# Altium schematic sheet Power.SchDoc: N64 Controller
size A4; DrawnBy: TheComet
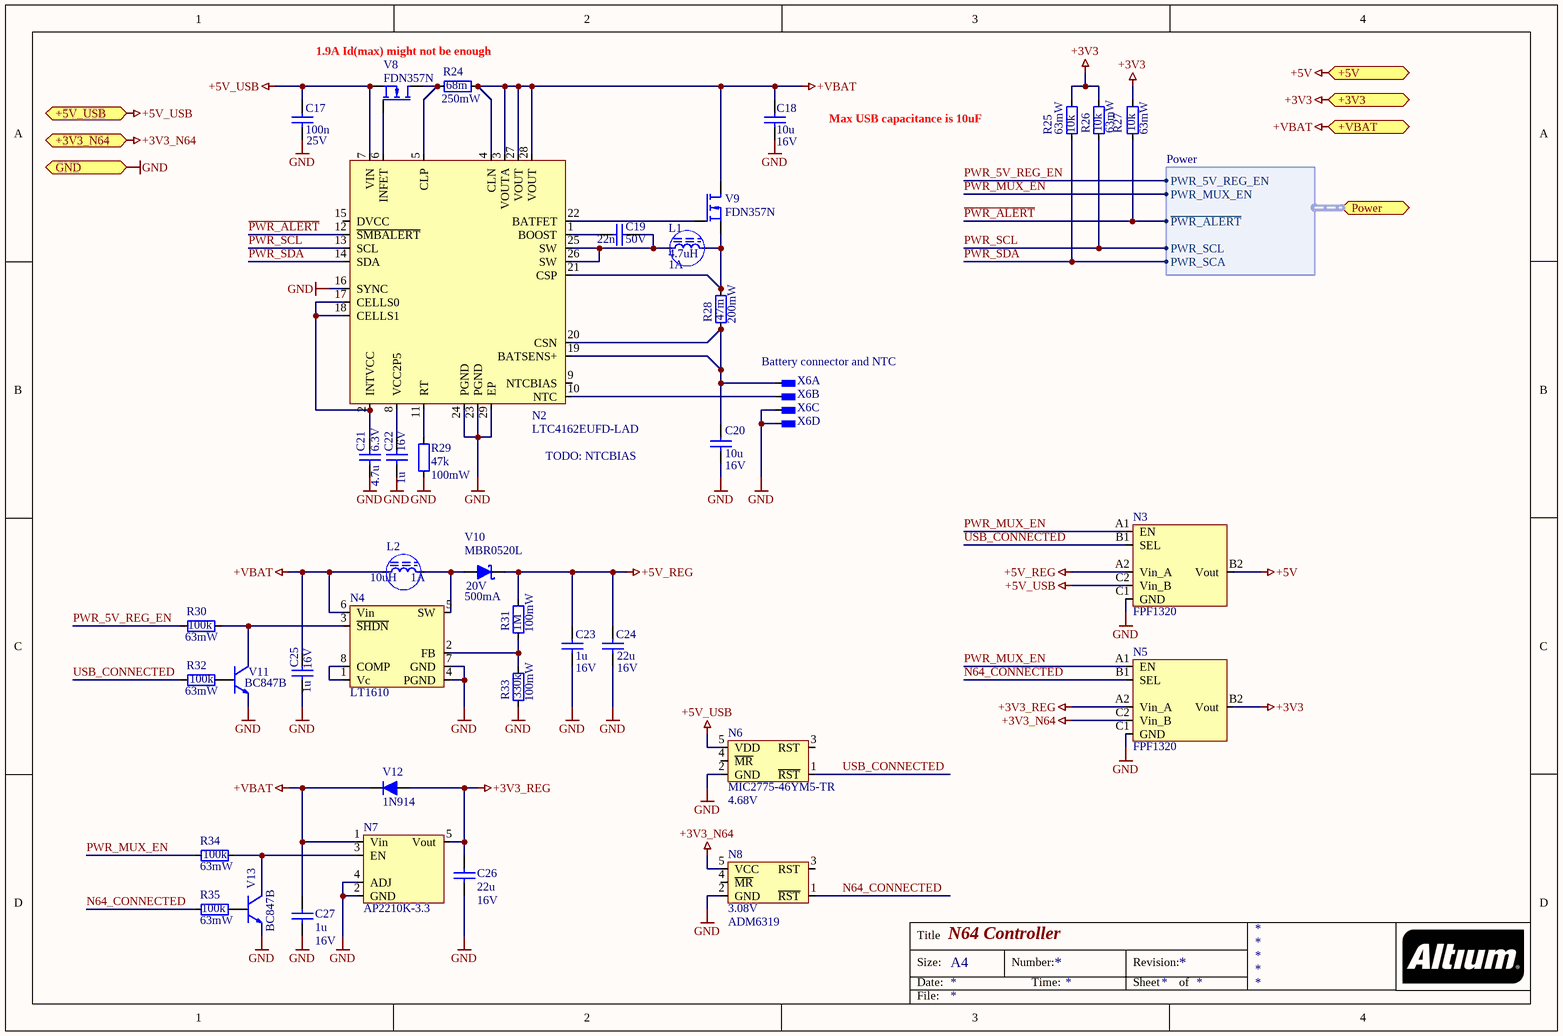
[diagram p0: Power.SchDoc]

## Parts
C17  value 100n  Value2: 25V  [SMD_CAP_0402]  (hidden comment: C_SMD_CER_100N_25V_10%_X7R_0402)
C18  value 10u  Value2: 16V  [SMD_CAP_0805]  (hidden comment: C_SMD_CER_10U_16V_10%_X7R_0805)
C19  value 22n  Value2: 50V  [SMD_CAP_0402]  (hidden comment: C_SMD_CER_22N_50V_10%_X7R_0402)
C20  value 10u  Value2: 16V  [SMD_CAP_0805]  (hidden comment: C_SMD_CER_10U_16V_10%_X7R_0805)
C21  value 4.7u  Value2: 6.3V  [SMD_CAP_0603]  (hidden comment: C_SMD_CER_4U7_6V3_10%_X5R_0603)
C22  value 1u  Value2: 16V  [SMD_CAP_0603]  (hidden comment: C_SMD_CER_1U_16V_10%_X7R_0603)
C23  value 1u  Value2: 16V  [SMD_CAP_0603]  (hidden comment: C_SMD_CER_1U_16V_10%_X7R_0603)
C24  value 22u  Value2: 16V  [SMD_CAP_0805]  (hidden comment: C_SMD_CER_22U_16V_10%_X5R_0805)
C25  value 1u  Value2: 16V  [SMD_CAP_0603]  (hidden comment: C_SMD_CER_1U_16V_10%_X7R_0603)
C26  value 22u  Value2: 16V  [SMD_CAP_0805]  (hidden comment: C_SMD_CER_22U_16V_10%_X5R_0805)
C27  value 1u  Value2: 16V  [SMD_CAP_0603]  (hidden comment: C_SMD_CER_1U_16V_10%_X7R_0603)
L1  value 4.7uH  Value2: 1A  [SMD_IND_0806]  (hidden comment: L_SMD_FERRITE_SHIELD_4U7_1A_20%_0806)
L2  value 10uH  Value2: 1A  [SMD_INDUCT-744025100]  (hidden comment: L_SMD_FERRITE_SHIELD_10U_1A_190MOHM_20%)
N2  Type: LTC4162EUFD-LAD  [QFN50P400X500X80_HS-29N]  (hidden comment: N_LTC4162EUFD-LAD_QFN-28)
N3  Type: FPF1320  [SMD_WLCSP_6_1.0X1.5]  (hidden comment: *)
N4  Type: LT1610  [SMD_MSOP-8]  (hidden comment: N_LT1610_MSOP-8)
N5  Type: FPF1320  [SMD_WLCSP_6_1.0X1.5]  (hidden comment: *)
N6  value 4.68V  Type: MIC2775-46YM5-TR  [SMD_SOT_23_5]  (hidden comment: N_MIC2775-46YM5-TR_SOT-23-5)
N7  AP2210K-3.3  [SMD_SOT_23_5]
N8  value 3.08V  Type: ADM6319  [SMD_SOT_23_5]  (hidden comment: N_ADM6319B31ARJZ-RL7_SOT-23-5)
R24  value 68m  Value2: 250mW  [SMD_RES_0603]  (hidden comment: R_SMD_THINFILM_0E068_0W25_1%_350PPM_0603)
R25  value 10k  Value2: 63mW  [SMD_RES_0402]  (hidden comment: R_SMD_THINFILM_10K_0W063_0%5_25PPM_0402)
R26  value 10k  Value2: 63mW  [SMD_RES_0402]  (hidden comment: R_SMD_THINFILM_10K_0W063_0%5_25PPM_0402)
R27  value 10k  Value2: 63mW  [SMD_RES_0402]  (hidden comment: R_SMD_THINFILM_10K_0W063_0%5_25PPM_0402)
R28  value 47m  Value2: 200mW  [SMD_RES_0603]  (hidden comment: R_SMD_THICKFILM_0E047_0W2_1%_200PPM_0603)
R29  value 47k  Value2: 100mW  [SMD_RES_0402]  (hidden comment: R_SMD_THINFILM_47K_0W1_0%5_25PPM_0402)
R30  value 100k  Value2: 63mW  [SMD_RES_0402]  (hidden comment: R_SMD_THINFILM_100K_0W063_1%_50PPM_0402)
R31  value 1M  Value2: 100mW  [SMD_RES_0402]  (hidden comment: R_SMD_THINFILM_1M_0W1_1%_50PPM_0402)
R32  value 100k  Value2: 63mW  [SMD_RES_0402]  (hidden comment: R_SMD_THINFILM_100K_0W063_1%_50PPM_0402)
R33  value 330k  Value2: 100mW  [SMD_RES_0402]  (hidden comment: R_SMD_THINFILM_330K_0W1_1%_50PPM_0402)
R34  value 100k  Value2: 63mW  [SMD_RES_0402]  (hidden comment: R_SMD_THINFILM_100K_0W063_1%_50PPM_0402)
R35  value 100k  Value2: 63mW  [SMD_RES_0402]  (hidden comment: R_SMD_THINFILM_100K_0W063_1%_50PPM_0402)
V8  Type: FDN357N  [SMD_SOT_23_3]  (hidden comment: V_SMD_FET_NMOS_FDN357N_30V_1A9_4NC2_0W5_SOT-23-3)
V9  Type: FDN357N  [SMD_SOT_23_3]  (hidden comment: V_SMD_FET_NMOS_FDN357N_30V_1A9_4NC2_0W5_SOT-23-3)
V10  value 20V  Type: MBR0520L  Value2: 500mA  [SMD_SOD_123]  (hidden comment: V_SMD_SCHOTTKY_MBR0520L_20V_0A5_SOD-123)
V11  Type: BC847B  [SMD_SOT_23_3]  (hidden comment: V_SMD_TRANS_NPN_BC847B_50V_0A2_SOT-23-3)
V12  Type: 1N914  [SMD_SOD_323]  (hidden comment: V_SMD_DIODE_1N914_75V_0A15_SOD-323)
V13  Type: BC847B  [SMD_SOT_23_3]  (hidden comment: V_SMD_TRANS_NPN_BC847B_50V_0A2_SOT-23-3)
X6  X_CONNECTOR_P2.54_D0.9_1X4  [THT_CON_P2.54_D0.9_1X4]  (value not drawn)  (parts A,B,C,D of 4)

## Ports
+3V3, +3V3_N64, +5V, +5V_USB, +VBAT, GND, Power (harness Power)

## Harnesses
Power: PWR_5V_REG_EN, ~{PWR_ALERT}, PWR_MUX_EN, PWR_SCL, PWR_SCA

## Nets
+3V3: N5.B2(Vout) R25.2 R26.2 R27.2 ; port +3V3
+3V3_N64: N5.C2(Vin_B) N8.5(VCC) ; port +3V3_N64
+3V3_REG: C26.2 N5.A2(Vin_A) N7.5(Vout) V12.1
+5V: N3.B2(Vout) ; port +5V
+5V_REG: C23.2 C24.2 N3.A2(Vin_A) R31.2 V10.2
+5V_USB: C17.2 N2.7(VIN) N3.C2(Vin_B) N6.5(VDD) V8.2(Source) ; port +5V_USB
+VBAT: C18.2 C25.2 C27.2 L2.1 N2.3(VOUTA) N2.4(CLN) N2.27(VOUT) N2.28(VOUT) N4.6(Vin) N7.1(Vin) R24.2 V9.3(Drain) V12.2 ; port +VBAT
GND: C17.1 C18.1 C20.1 C21.1 C22.1 C23.1 C24.1 C25.1 C26.1 C27.1 N2.16(SYNC) N2.23(PGND) N2.24(PGND) N2.29(EP) N3.C1(GND) N4.4(PGND) N4.7(GND) N5.C1(GND) N6.2(GND) N7.2(GND) N7.4(ADJ) N8.2(GND) R29.1 R33.1 V11.2(E) V13.2(E) X6.3 X6.4 ; port GND
N64_CONNECTED: N5.B1(SEL) N8.1(~{RST}) R35.1
~{PWR_ALERT}: N2.12(~{SMBALERT}) R27.1 ; port Power.~{PWR_ALERT}
PWR_5V_REG_EN: R30.1 ; port Power.PWR_5V_REG_EN
PWR_MUX_EN: N3.A1(EN) N5.A1(EN) R34.1 ; port Power.PWR_MUX_EN
PWR_SCL: N2.13(SCL) R26.1 ; port Power.PWR_SCL
PWR_SDA: N2.14(SDA) R25.1 ; port Power.PWR_SCA
USB_CONNECTED: N3.B1(SEL) N6.1(~{RST}) R32.1
NetC19_1: C19.1 N2.1(BOOST)
NetC19_2: C19.2 L1.1 N2.25(SW) N2.26(SW)
NetC20_2: C20.2 N2.19(BATSENS+) N2.20(CSN) R28.1 X6.1
NetC21_2: C21.2 N2.2(INTVCC) N2.17(CELLS0) N2.18(CELLS1)
NetC22_2: C22.2 N2.8(VCC2P5)
NetL1_2: L1.2 N2.21(CSP) R28.2 V9.2(Source)
NetL2_2: L2.2 N4.5(SW) V10.1
NetN2_5: N2.5(CLP) R24.1 V8.3(Drain)
NetN2_6: N2.6(INFET) V8.1(Gate)
NetN2_10: N2.10(NTC) X6.2
NetN2_11: N2.11(RT) R29.2
NetN2_22: N2.22(BATFET) V9.1(Gate)
NetN4_1: N4.1(Vc) N4.8(COMP)
NetN4_2: N4.2(FB) R31.1 R33.2
NetN4_3: N4.3(~{SHDN}) R30.2 V11.3(C)
NetN7_3: N7.3(EN) R34.2 V13.3(C)
NetR32_2: R32.2 V11.1(B)
NetR35_2: R35.2 V13.1(B)

Not connected (* = marked no-connect by the designer): N2 9(NTCBIAS) 15(DVCC); N6 3(RST) 4(~{MR}); N8 3(RST) 4(~{MR})

## Notes on the sheet
- 1.9A Id(max) might not be enough
- Max USB capacitance is 10uF
- (near X6) Battery connector and NTC
- (near N2) TODO: NTCBIAS
- Title
- Size:
- Date:
- A4
- Number:
- Time:
- Revision:
- Sheet
- of
- File:

## Library data of the parts
C17 = C_SMD_CER_100N_25V_10%_X7R_0402: 0.1µF ±10% 25V Ceramic Capacitor X7R 0402 (1005 Metric); Supplier - Digikey: 490-14603-1-ND
C18 C20 = C_SMD_CER_10U_16V_10%_X7R_0805: 10µF ±10% 16V Ceramic Capacitor X7R 0805 (2012 Metric); Supplier - Digikey: 1276-6472-1-ND
C19 = C_SMD_CER_22N_50V_10%_X7R_0402: 0.022µF ±10% 50V Ceramic Capacitor X7R 0402 (1005 Metric); Supplier - Digikey: 490-3884-1-ND
C22 C23 C25 C27 = C_SMD_CER_1U_16V_10%_X7R_0603: 1µF ±10% 16V Ceramic Capacitor X7R 0603 (1608 Metric); Supplier - Digikey: 1276-1019-1-ND
C24 C26 = C_SMD_CER_22U_16V_10%_X5R_0805: 22µF ±10% 16V Ceramic Capacitor X5R 0805 (2012 Metric); Supplier - Digikey: 1276-7092-1-ND
L1 = L_SMD_FERRITE_SHIELD_4U7_1A_20%_0806: SMD Inductor; Supplier - Digikey: 732-2956-1-ND
L2 = L_SMD_FERRITE_SHIELD_10U_1A_190MOHM_20%: FIXED IND 10UH 1A 190 MOHM SMD; Type: 744025100; Supplier - Digikey: 732-2617-1-ND
N2 = N_LTC4162EUFD-LAD_QFN-28: 35V/3.2A MULTI-CELL LITHIUM-ION; Supplier - Digikey: LTC4162EUFD-LAD#PBF-ND
N3 N5 = N_FPF1320UCX_WLCSP-6: Power Switch/Driver 2:1 P-Channel 1.5A 6-WLCSP (0.96x1.66); Supplier - Digikey: FPF1320UCXCT-ND
N6 = N_MIC2775-46YM5-TR_SOT-23-5: IC SUPERVISOR MICROPOWER SOT23-5; Supplier - Digikey: 576-2684-1-ND
N7 = N_AP2210K-3.3_SOT-23-5: IC REG LINEAR 3.3V 300MA SOT23-5; Supplier - Digikey: AP2210K-3.3TRG1DICT-ND; Type: AP2210K-3.3
N8 = N_ADM6319B31ARJZ-RL7_SOT-23-5: IC SUPERVISOR MANUAL RST SOT23-5; Supplier - Digikey: ADM6319B31ARJZ-RL7DKR-ND
R24 = R_SMD_THINFILM_0E068_0W25_1%_350PPM_0603: 68 mOhms ±1% 0.25W, 1/4W Chip Resistor 0603 (1608 Metric) Current Sense Thin Film; Supplier - Digikey: 408-1445-1-ND
R25-R27 = R_SMD_THINFILM_10K_0W063_0%5_25PPM_0402: SMD Resistor; Supplier - Digikey: P10KDECT-ND
R28 = R_SMD_THICKFILM_0E047_0W2_1%_200PPM_0603: 47 mOhms ±1% 0.2W, 1/5W Chip Resistor 0603 (1608 Metric) Automotive AEC-Q200, Current Sense Thick Film; Supplier - Digikey: P47LJCT-ND
R29 = R_SMD_THINFILM_47K_0W1_0%5_25PPM_0402: 47 kOhms ±0.5% 0.063W, 1/16W Chip Resistor 0402 (1005 Metric) Automotive AEC-Q200 Thin Film; Supplier - Digikey: P47KDECT-ND
R30 R32 R34 R35 = R_SMD_THINFILM_100K_0W063_1%_50PPM_0402: 100 kOhms ±1% 0.063W, 1/16W Chip Resistor 0402 (1005 Metric) Thin Film; Supplier - Digikey: YAG2307CT-ND
R31 = R_SMD_THINFILM_1M_0W1_1%_50PPM_0402: 1 MOhms ±1% 0.1W, 1/10W Chip Resistor 0402 (1005 Metric) Anti-Sulfur Thin Film; Supplier - Digikey: MCS0402-1.00M-CFCT-ND
R33 = R_SMD_THINFILM_330K_0W1_1%_50PPM_0402: 330 kOhms ±1% 0.1W, 1/10W Chip Resistor 0402 (1005 Metric) Anti-Sulfur Thin Film; Supplier - Digikey: 749-1575-1-ND
V8 V9 = V_SMD_FET_NMOS_FDN357N_30V_1A9_4NC2_0W5_SOT-23-3: N-Channel Logic Level Enhancement Mode Field Effect Transistor; Supplier - E+H-flowtec SAP: 50110216; Supplier - Digikey: FDN357NCT-ND
V10 = V_SMD_SCHOTTKY_MBR0520L_20V_0A5_SOD-123: DIODE SCHOTTKY 20V 500MA SOD123; Supplier - Digikey: MBR0520LCT-ND
V11 V13 = V_SMD_TRANS_NPN_BC847B_50V_0A2_SOT-23-3: NPN Transistor; Supplier - E+H-flowtec SAP: 50019820; Supplier - Digikey: BC847BLT1GOSCT-ND
V12 = V_SMD_DIODE_1N914_75V_0A15_SOD-323: SMD Diode, 75V, 0.15A; Supplier - Digikey: 1N914BWSCT-ND
X6 = X_CONNECTOR_P2.54_D0.9_1X4: Pitch 2.54, Diameter 0.9mm, 1 row, 4 columns; Type: Pitch 2.54, Diameter 0.9mm, 1 row, 3 columns
C21 = C_SMD_CER_4U7_6V3_10%_X5R_0603: Supplier - Digikey: 1276-1045-1-ND
N4 = N_LT1610_MSOP-8: Supplier - Digikey: LT1610CMS8#PBF-ND